# EAGLE design Wheel (EAGLE 9.2.2)
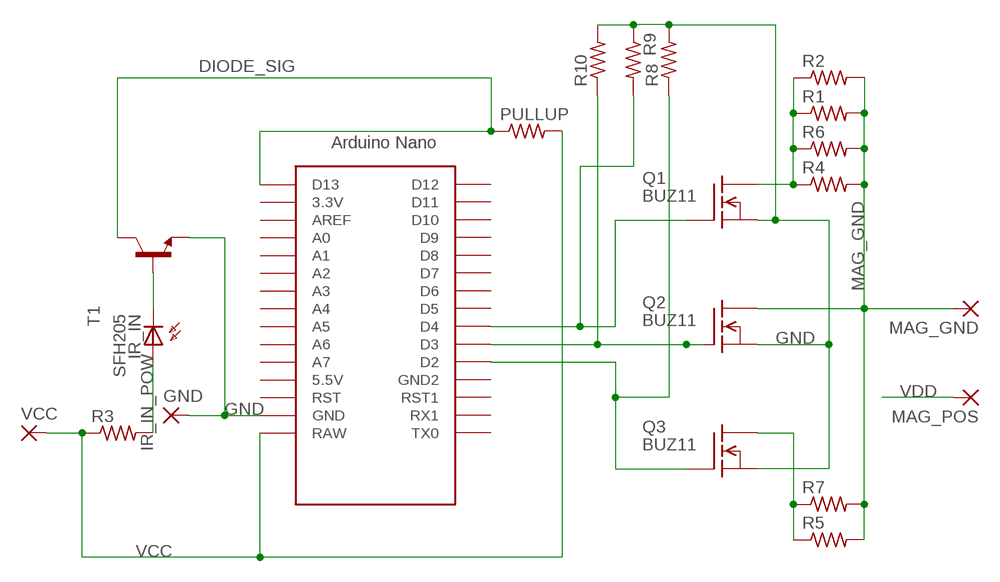
[diagram p0: schematic, sheet 1]

## Parts
GND  3,81/1,4  [3,81/1,4]
IR_IN  SFH205  [SFH205]
MAG_GND  3,81/1,4  [3,81/1,4]
MAG_POS  3,81/1,4  [3,81/1,4]
PULLUP  R-US_0204/7  [0204/7]
Q1  BUZ11  [TO220]
Q2  BUZ11  [TO220]
Q3  BUZ11  [TO220]
R1  R-US_0204/7  [0204/7]
R2  R-US_0204/7  [0204/7]
R3  R-US_0204/7  [0204/7]
R4  R-US_0204/7  [0204/7]
R5  R-US_0204/7  [0204/7]
R6  R-US_0204/7  [0204/7]
R7  R-US_0204/7  [0204/7]
R8  R-US_0204/7  [0204/7]
R9  R-US_0204/7  [0204/7]
R10  R-US_0204/7  [0204/7]
T1  -NPN-TO92-EBC  [TO92-EBC]
U$1  NANO  [NANO]
VCC  3,81/1,4  [3,81/1,4]

## Nets
D2_SIG: Q3.1(G) R8.1 U$1.D2
D3_SIG: Q2.1(G) R10.1 U$1.D3
D4_SIG: Q1.1(G) R9.2 U$1.D4
DIODE_SIG: PULLUP.1 T1.C U$1.D13
DIODE_SIG_LOW: IR_IN.K(C) T1.B
GND: GND.1(P) Q1.3(S) Q2.3(S) Q3.3(S) R8.2 R9.1 R10.2 T1.E U$1.GND
IR_IN_POW: IR_IN.A R3.2
LOW_SPEED_GND: Q1.2(D) R1.1 R2.1 R4.1 R6.1
MAG_GND: MAG_GND.1(P) Q2.2(D) R1.2 R2.2 R4.2 R5.2 R6.2 R7.2
MED_SPEED_GND: Q3.2(D) R5.1 R7.1
VCC: PULLUP.2 R3.1 U$1.RAW VCC.1(P)
VDD: MAG_POS.1(P)
Unconnected: U$1.3.3V U$1.5V(5.5V) U$1.A0 U$1.A1 U$1.A2 U$1.A3 U$1.A4 U$1.A5 U$1.A6 U$1.A7 U$1.AREF U$1.D5 U$1.D6 U$1.D7 U$1.D8 U$1.D9 U$1.D10 U$1.D11 U$1.D12 U$1.GND1(GND2) U$1.ICSP1 U$1.ICSP2 U$1.ICSP3 U$1.ICSP4 U$1.ICSP5 U$1.ICSP6 U$1.RST U$1.RST1 U$1.RX1 U$1.TX0

## Library data of the parts
GND MAG_GND MAG_POS VCC = wirepad:3,81/1,4: THROUGH-HOLE PAD
IR_IN = opto-trans-siemens:SFH205: PHOTO DIODE; OC_FARNELL: unknown; OC_NEWARK: unknown
PULLUP R1-R10 = rcl:R-US_: RESISTOR, American symbol; SPICEPREFIX: R
Q1-Q3 = transistor-fet:BUZ11: N-Channel Enhancement MOSFET 50V; 30A; 0,040Ohm
T1 = transistor:*-NPN-: NPN Transistror BF959 corrected 2008.03.06
U$1 = Arduino-clone:NANO: Arduino Nano

## Net classes
0 default: width 1.016 mm, drill 1 mm, clearance 0.95 mm
1 small: width 0.5 mm, drill 1 mm, clearance 0.5 mm

## Board
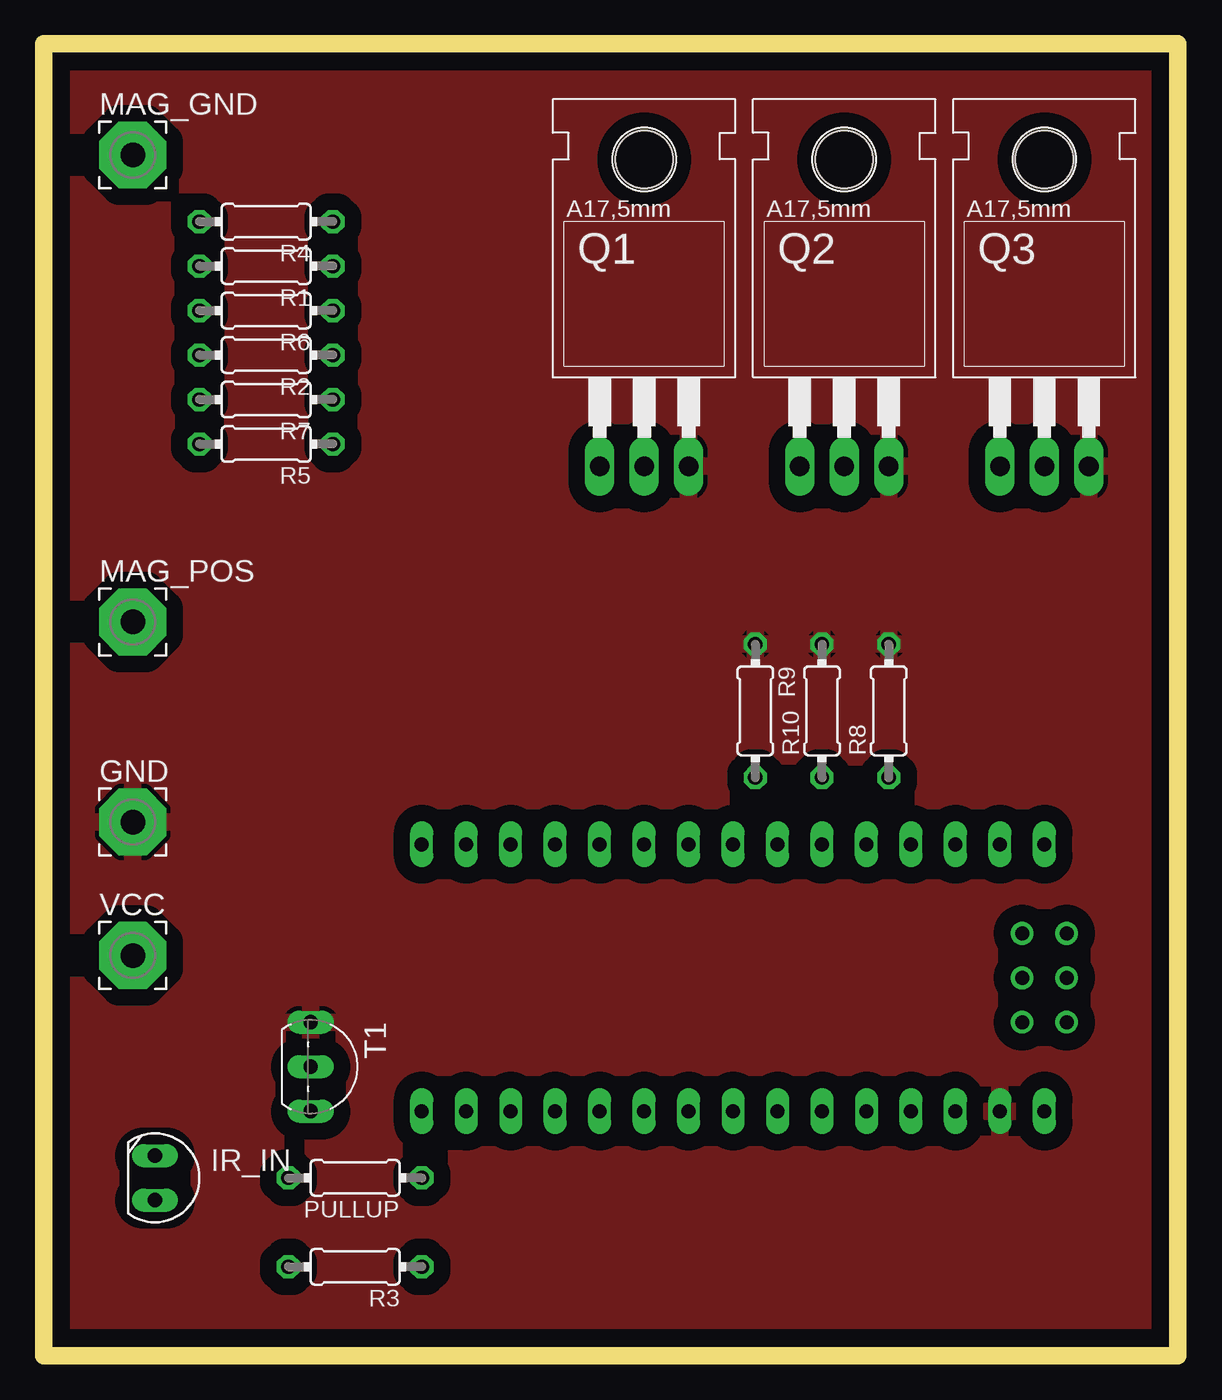
[diagram p1: board, top side]
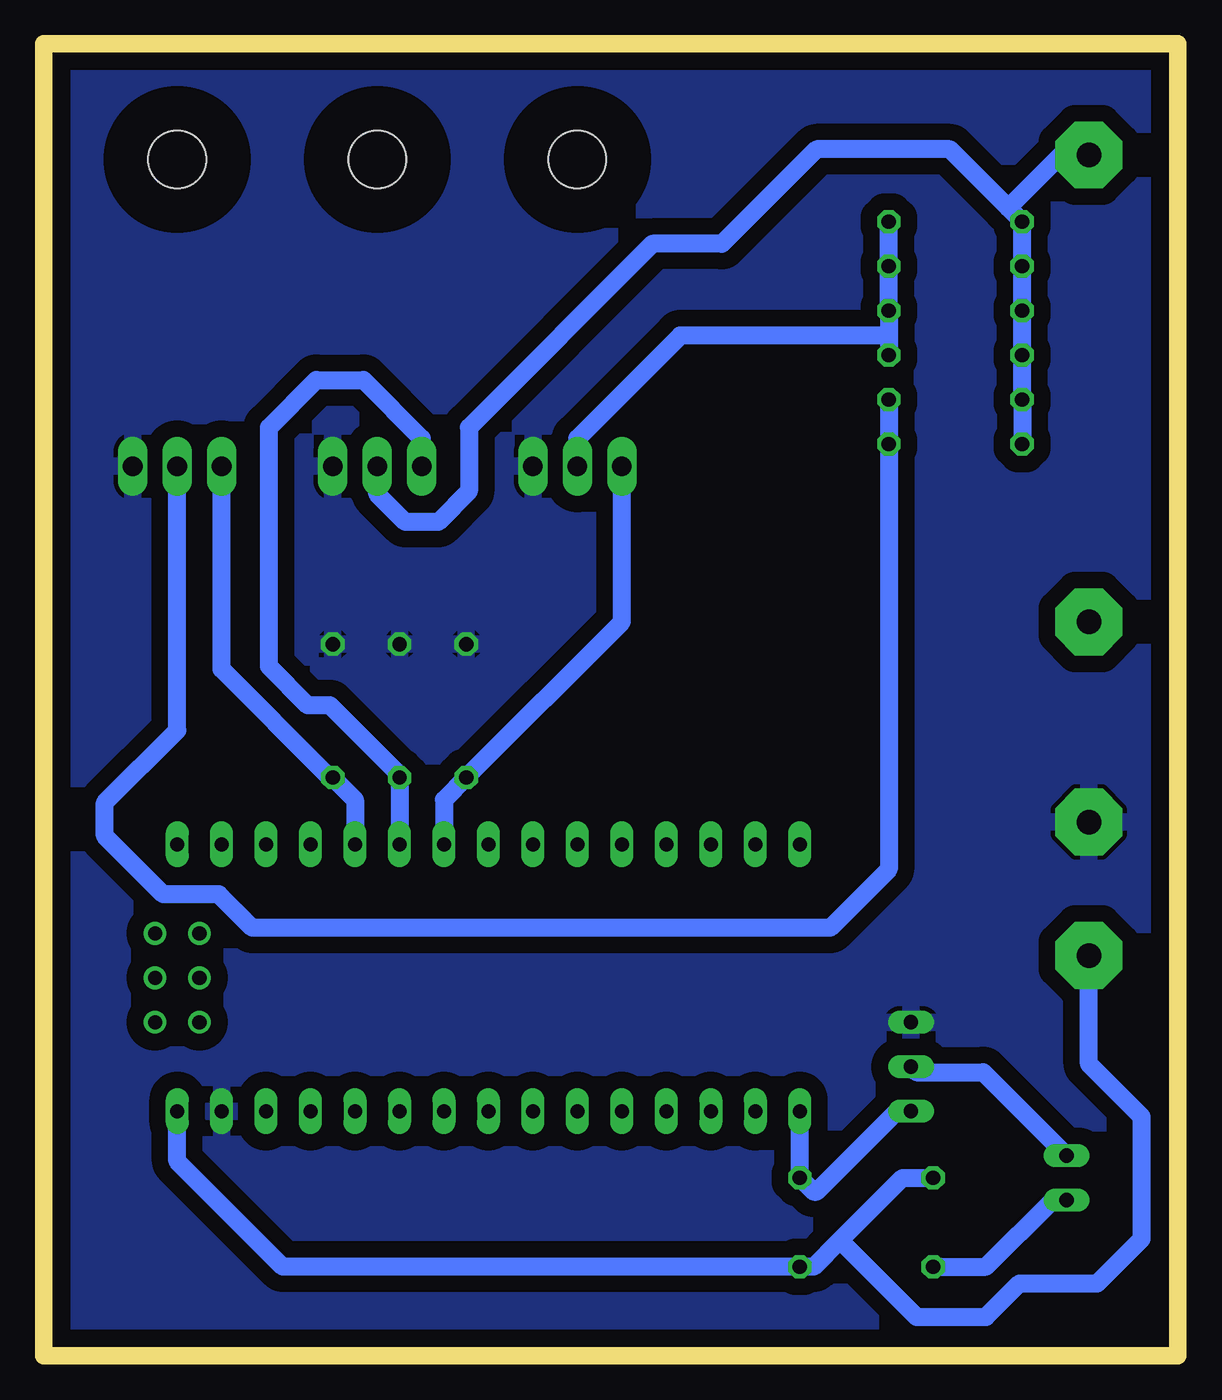
[diagram p2: board, bottom side, seen from below]

Size 64.77 x 74.93 mm. Coordinates in mm from the lower left corner, seen from the top.
Outline: 0,74.93 64.77,74.93 64.77,0 0,0 0,74.93
Copper layers (1*16): Top 0.035mm / dielectric 1.5mm / Bottom 0.035mm
Design rules "default": minimum track width 6mil, minimum drill 0.35mm, track to track 6mil, track to pad 6mil, pad to pad 6mil, via to via 6mil, smd to smd 6mil, copper to edge 40mil, drill to drill 6mil, minimum pad ring 10mil, minimum via ring 8mil, stop-mask expansion 4mil, vias tented up to drill 0mil, thermal gap 10mil

### Footprints (pad centres in the part's own frame; a part is rotated, then mirrored left to right if it is on the bottom)
3,81/1,4 = drill 1.397 pad 3.81 octagon: 1 0,0
SFH205 = drill 0.813 long: A 0,-1.27; K 0,1.27
0204/7 = drill 0.813 octagon: 1 -3.81,0; 2 3.81,0
TO220 = drill 1.118 long: 1 -2.54,-6.35; 2 0,-6.35; 3 2.54,-6.35 | hole 3.302: 0,11.176
TO92-EBC = drill 0.813 long: B 0,-1.27; C 2.54,-1.27; E -2.54,-1.27
NANO = drill 0.8 long: 3.3V -10.16,24.13; 5V -10.16,-1.27; A0 -10.16,19.05; A1 -10.16,16.51; A2 -10.16,13.97; A3 -10.16,11.43; A4 -10.16,8.89; A5 -10.16,6.35; A6 -10.16,3.81; A7 -10.16,1.27; AREF -10.16,21.59; D2 5.08,1.27; D3 5.08,3.81; D4 5.08,6.35; D5 5.08,8.89; D6 5.08,11.43; D7 5.08,13.97; D8 5.08,16.51; D9 5.08,19.05; D10 5.08,21.59; D11 5.08,24.13; D12 5.08,26.67; D13 -10.16,26.67; GND -10.16,-6.35; GND1 5.08,-1.27; RAW -10.16,-8.89; RST -10.16,-3.81; RST1 5.08,-3.81; RX1 5.08,-6.35; TX0 5.08,-8.89 | drill 0.8: ICSP1 -5.08,-10.16; ICSP2 -5.08,-7.62; ICSP3 -2.54,-10.16; ICSP4 -2.54,-7.62; ICSP5 0,-10.16; ICSP6 0,-7.62

### Placement (x,y rotation side)
GND  5.08,30.48 0 top
IR_IN  6.35,10.16 0 top
MAG_GND  5.08,68.58 0 top
MAG_POS  5.08,41.91 0 top
PULLUP  17.78,10.16 180 top
Q1  34.29,57.15 0 top
Q2  45.72,57.15 0 top
Q3  57.15,57.15 0 top
R1  12.7,62.23 180 top
R2  12.7,57.15 180 top
R3  17.78,5.08 180 top
R4  12.7,64.77 180 top
R5  12.7,52.07 180 top
R6  12.7,59.69 180 top
R7  12.7,54.61 180 top
R8  48.26,36.83 90 top
R9  40.64,36.83 270 top
R10  44.45,36.83 90 top
T1  16.51,16.51 270 top
U$1  48.26,24.13 90 top
VCC  5.08,22.86 0 top

### Tracks (layer width: path | path; a pad name or v marks a point on that pad's centre or on a via)
D2_SIG
  Bottom 1.016: U$1.D2 46.99,31.75 R8.1 48.58,33.18 54.61,39.21 Q3.1
D3_SIG
  Bottom 1.016: U$1.D3 R10.1 44.61,33.34 48.42,37.15 49.69,37.15 51.91,39.37 51.91,53.02 49.21,55.72 46.51,55.72 43.18,52.39 Q2.1
D4_SIG
  Bottom 1.016: U$1.D4 41.91,31.75 R9.2 31.75,41.91 Q1.1
DIODE_SIG
  Bottom 1.016: U$1.D13 PULLUP.1 20.8,9.37 20.64,9.37 16.03,13.97 T1.C
DIODE_SIG_LOW
  Bottom 1.016: IR_IN.K 11.11,16.19 14.92,16.19 T1.B
GND
  pour Top: 0,74.93 64.77,74.93 64.77,0 0,0
  pour Bottom: 0,74.93 64.77,74.93 64.77,0 0,0
IR_IN_POW
  Bottom 1.016: IR_IN.A 7.14,8.89 10.95,5.08 R3.2
LOW_SPEED_GND
  Bottom 1.016: 16.51,58.26 R6.1 R1.1 R4.1 | 16.51,58.26 R2.1 | Q1.2 34.29,52.39 28.42,58.26 16.51,58.26
MAG_GND
  Bottom 1.016: R5.2 R7.2 R2.2 R6.2 R1.2 R4.2 9.68,65.56 | Q2.2 45.72,49.21 44.13,47.62 42.23,47.62 40.48,49.37 40.48,53.02 30,63.5 26.04,63.5 20.64,68.9 13.02,68.9 9.68,65.56 | MAG_GND.1 6.67,68.58 9.68,65.56
MED_SPEED_GND
  Bottom 1.016: R7.1 R5.1 16.51,27.78 19.84,24.45 52.86,24.45 54.77,26.35 57.94,26.35 61.28,29.69 61.28,31.59 57.15,35.72 Q3.2
VCC
  Bottom 1.016: U$1.RAW 57.15,11.11 51.12,5.08 R3.1 20.8,5.08 19.29,6.59 | PULLUP.2 15.72,10.16 19.29,6.59 | VCC.1 5.08,16.67 2.06,13.65 2.06,6.67 4.6,4.13 9.05,4.13 10.95,2.22 14.92,2.22 19.29,6.59